# EAGLE design ESP32_sparrow (EAGLE 9.6.2)

## Sheet 1 of 2
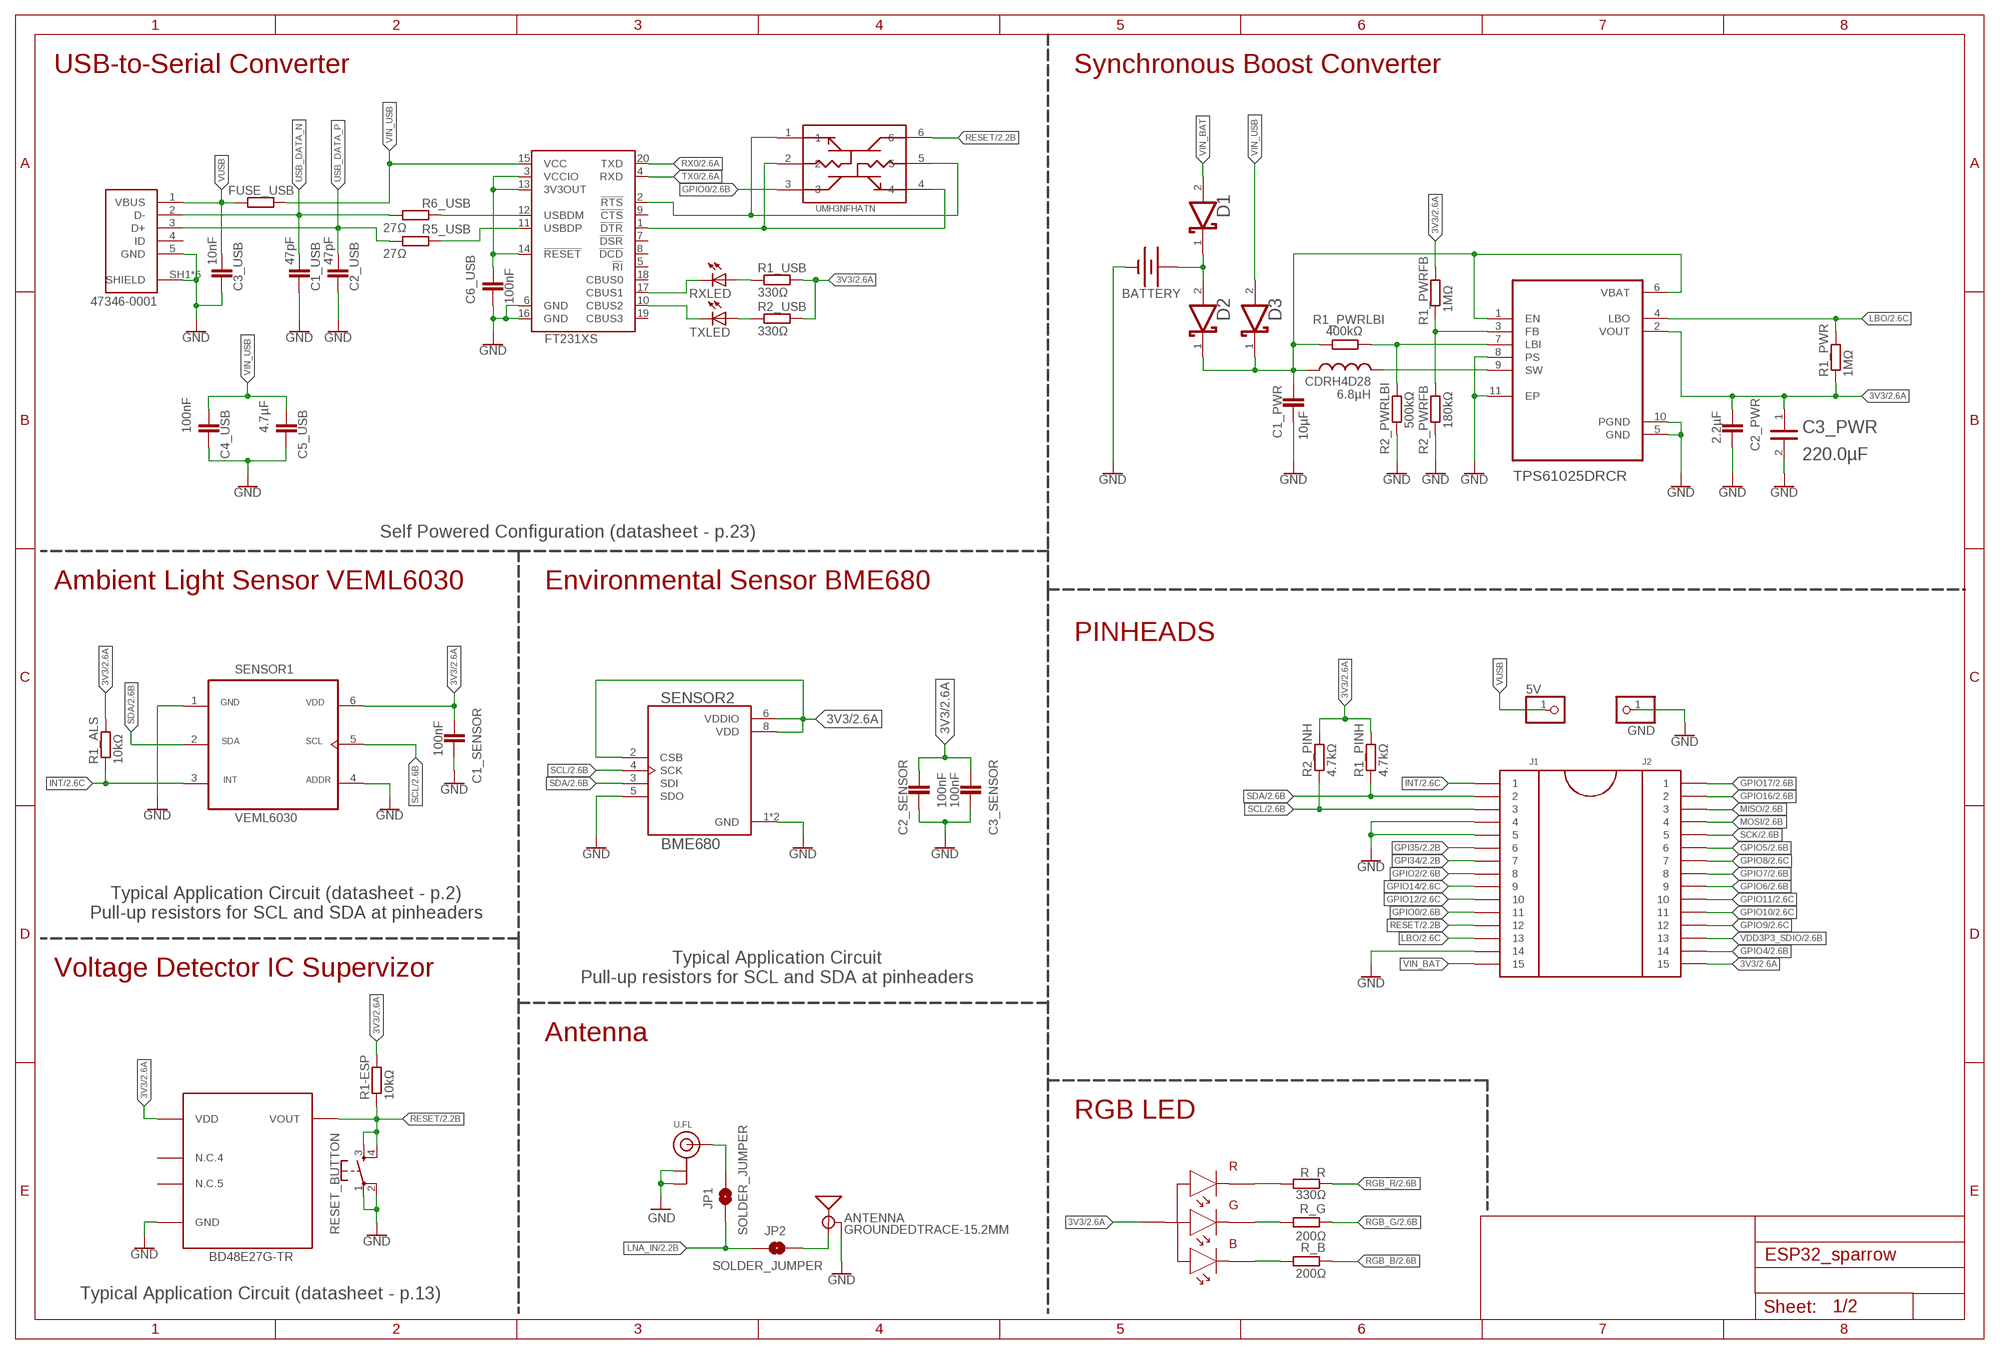
[diagram p0: schematic, sheet 1]

### Parts
5V  PINHD-1X1  [1X01]
ANTENNA  GROUNDEDTRACE-15.2MM  ANTENNA-GROUNDEDTRACE-15.2MM  [TRACE_ANTENNA_2.4GHZ_15.2MM]
BATTERY  BATTERY-AA  [BATTERY-AA]
BD48E27G-TR  BD48E27G-TR  [SSOP5]
C1_PWR  10µF  CC0402  [C0402]
C1_SENSOR  100nF  CC0402  [C0402]
C1_USB  47pF  CC0402  [C0402]
C2_PWR  2.2µF  CC0402  [C0402]
C2_SENSOR  100nF  CC0402  [C0402]
C2_USB  47pF  CC0402  [C0402]
C3_PWR  SAMSUNG_ELECTRO-MECHANICS_AMERICA_CL32A227MQVNNNESAMSUNG_ELECTRO-MECHANICS_AMERICA_CL32A227MQVNNNE_0_0  [SAMSUNG_ELECTRO-MECHANICS_AMERICA_CL32A227MQVNNNE_0]
C3_SENSOR  100nF  CC0402  [C0402]
C3_USB  10nF  CC0402  [C0402]
C4_USB  100nF  CC0402  [C0402]
C5_USB  4.7µF  CC0402  [C0402]
C6_USB  100nF  CC0402  [C0402]
CDRH4D28  6.8µH  L_US-CDRH4D28  [INDUCTOR_CDRH4]
CONVERTER  TPS61025DRCR  [VREG_V62/16624-01YE]
D1  AVX_SD0805S020S1R0AVX_SD0805S020S1R0_0_0  [AVX_SD0805S020S1R0_0]
D2  AVX_SD0805S020S1R0AVX_SD0805S020S1R0_0_0  [AVX_SD0805S020S1R0_0]
D3  AVX_SD0805S020S1R0AVX_SD0805S020S1R0_0_0  [AVX_SD0805S020S1R0_0]
FUSE_USB  PFMF.050.2  R-EU_1812X7R  [1812X7R]
GND  PINHD-1X1  [1X01]
J1  HEAD15-NOSS  [HEAD15-NOSS]
J2  HEAD15-NOSS-1  [HEAD15-NOSS-1]
JP1  SOLDER_JUMPER  JUMPER-SMT_2_NO_NO-SILK  [SMT-JUMPER_2_NO_NO-SILK]
JP2  SOLDER_JUMPER  JUMPER-SMT_2_NO_NO-SILK  [SMT-JUMPER_2_NO_NO-SILK]
MOLEX  47346-0001  [MOLEX_47346-0001]
R1-ESP  10kΩ  RR0402  [R0402]
R1_ALS  10kΩ  RR0402  [R0402]
R1_PINH  4.7kΩ  RR0402  [R0402]
R1_PWR  1MΩ  RR0402  [R0402]
R1_PWRFB  1MΩ  RR0402  [R0402]
R1_PWRLBI  400kΩ  RR0402  [R0402]
R1_USB  330Ω  RR0402  [R0402]
R2_PINH  4.7kΩ  RR0402  [R0402]
R2_PWRFB  180kΩ  RR0402  [R0402]
R2_PWRLBI  500kΩ  RR0402  [R0402]
R2_USB  330Ω  RR0402  [R0402]
R5_USB  27Ω  RR0402  [R0402]
R6_USB  27Ω  RR0402  [R0402]
R_B  200Ω  RR0402  [R0402]
R_G  200Ω  RR0402  [R0402]
R_R  330Ω  RR0402  [R0402]
RESET_BUTTON  MOMENTARY-SWITCH-SPST-2-SMD-4.6X2.8MM  [TACTILE_SWITCH_SMD_4.6X2.8MM]
RXLED  LEDCHIP-LED0603  [CHIP-LED0603]
SENSOR1  VEML6030  [VISHAY_VEML6030_2X2X0.87]
SENSOR2  BME680  [PSON80P300X300X100-8N]
TXLED  LEDCHIP-LED0603  [CHIP-LED0603]
U4  FT231XS  [SSOP20_L]
U$1  150202M153130-RGB  [150202M153130]
U.FL  ANTENNA_U.FL  [U.FL]
UMH3NFHATN  UMH3NFHATN  UMH3N  [SOP65P210X100-6N]

### Nets
3V3: BD48E27G-TR.P$2(VDD) C1_SENSOR.2 C2_PWR.2 C2_SENSOR.2 C3_PWR.1 C3_SENSOR.2 CONVERTER.2(VOUT) J2.15 R1-ESP.2 R1_ALS.2 R1_PINH.2 R1_PWR.1 R1_PWRFB.2 R1_USB.2 R2_PINH.2 R2_USB.2 SENSOR1.6(VDD) SENSOR2.2(CSB) SENSOR2.6(VDDIO) SENSOR2.8(VDD) U$1.P$1 ; also sheet 2
GND: ANTENNA.GND BATTERY.GND@1(-) BD48E27G-TR.P$3(GND) C1_PWR.1 C1_SENSOR.1 C1_USB.2 C2_PWR.1 C2_SENSOR.1 C2_USB.2 C3_PWR.2 C3_SENSOR.1 C3_USB.2 C4_USB.2 C5_USB.2 C6_USB.2 CONVERTER.5(GND) CONVERTER.8(PS) CONVERTER.10(PGND) CONVERTER.11(EP) GND.1 J1.4 J1.5 J1.14 MOLEX.5(GND) MOLEX.SH1(SHIELD) MOLEX.SH2(SHIELD) MOLEX.SH3(SHIELD) MOLEX.SH4(SHIELD) MOLEX.SH5(SHIELD) MOLEX.SH6(SHIELD) R2_PWRFB.1 R2_PWRLBI.1 RESET_BUTTON.1 RESET_BUTTON.2 SENSOR1.1(GND) SENSOR1.4(ADDR) SENSOR2.1(GND) SENSOR2.5(SDO) SENSOR2.7(GND) U4.6(GND) U4.16(GND) U.FL.1(GND) U.FL.2(GND) ; also sheet 2
GPI34: J1.7 ; also sheet 2
GPI35: J1.6 ; also sheet 2
GPIO0: J1.11 UMH3NFHATN.3 ; also sheet 2
GPIO2: J1.8 ; also sheet 2
GPIO4: J2.14 ; also sheet 2
GPIO5: J2.6 ; also sheet 2
GPIO6: J2.9 ; also sheet 2
GPIO7: J2.8 ; also sheet 2
GPIO8: J2.7 ; also sheet 2
GPIO9: J2.12 ; also sheet 2
GPIO10: J2.11 ; also sheet 2
GPIO11: J2.10 ; also sheet 2
GPIO12: J1.10 ; also sheet 2
GPIO14: J1.9 ; also sheet 2
GPIO16: J2.2 ; also sheet 2
GPIO17: J2.1 ; also sheet 2
INT: J1.1 R1_ALS.1 SENSOR1.3(INT) ; also sheet 2
LBO: CONVERTER.4(LBO) J1.13 R1_PWR.2 ; also sheet 2
LNA_IN: JP1.1 JP2.1 ; also sheet 2
MISO: J2.3 ; also sheet 2
MOSI: J2.4 ; also sheet 2
N$1: CONVERTER.7(LBI) R1_PWRLBI.2 R2_PWRLBI.2
N$3: R_B.2 U$1.P$4
N$4: R_G.2 U$1.P$3
N$5: R_R.2 U$1.P$2
N$6: U4.1(!DTR) UMH3NFHATN.2 UMH3NFHATN.4
N$7: U4.2(!RTS) UMH3NFHATN.1 UMH3NFHATN.5
N$8: ANTENNA.ANT(SIGNAL) JP2.2
N$9: C6_USB.1 U4.3(VCCIO) U4.13(3V3OUT) U4.14(!RESET)
N$10: C1_PWR.2 CDRH4D28.1 CONVERTER.1(EN) CONVERTER.6(VBAT) D2.1(CATHODE) D3.1(CATHODE) R1_PWRLBI.1
N$12: CONVERTER.3(FB) R1_PWRFB.1 R2_PWRFB.2
N$16: RXLED.C U4.17(CBUS1)
N$17: BATTERY.PWR@1(+) D1.1(CATHODE) D2.2(ANODE)
N$18: JP1.2 U.FL.3(SIGNAL)
N$20: R6_USB.2 U4.12(USBDM)
N$21: CDRH4D28.2 CONVERTER.9(SW)
N$22: R1_USB.1 RXLED.A
N$23: TXLED.C U4.10(CBUS2)
N$24: R2_USB.1 TXLED.A
N$26: R5_USB.2 U4.11(USBDP)
RESET: BD48E27G-TR.P$1(VOUT) J1.12 R1-ESP.1 RESET_BUTTON.3 RESET_BUTTON.4 UMH3NFHATN.6 ; also sheet 2
RGB_B: R_B.1 ; also sheet 2
RGB_G: R_G.1 ; also sheet 2
RGB_R: R_R.1 ; also sheet 2
RX0: U4.20(TXD) ; also sheet 2
SCK: J2.5 ; also sheet 2
SCL: J1.3 R2_PINH.1 SENSOR1.5(SCL) SENSOR2.4(SCK) ; also sheet 2
SDA: J1.2 R1_PINH.1 SENSOR1.2(SDA) SENSOR2.3(SDI) ; also sheet 2
TX0: U4.4(RXD) ; also sheet 2
USB_DATA_N: C1_USB.1 MOLEX.2(D-) R6_USB.1
USB_DATA_P: C2_USB.1 MOLEX.3(D+) R5_USB.1
VDD3P3_SDIO: J2.13 ; also sheet 2
VIN_BAT: D1.2(ANODE) J1.15
VIN_USB: C4_USB.1 C5_USB.1 D3.2(ANODE) FUSE_USB.2 U4.15(VCC)
VUSB: 5V.1 C3_USB.1 FUSE_USB.1 MOLEX.1(VBUS)
Unconnected: BD48E27G-TR.P$4(N.C.4) BD48E27G-TR.P$5(N.C.5) MOLEX.4(ID) U4.5(!RI) U4.7(!DSR) U4.8(!DCD) U4.9(!CTS) U4.18(CBUS0) U4.19(CBUS3)

### Notes on the sheet
- USB-to-Serial Converter | Synchronous Boost Converter
- Self Powered Configuration (datasheet - p.23)
- Ambient Light Sensor VEML6030 | Environmental Sensor BME680
- PINHEADS
- Typical Application Circuit (datasheet - p.2)
  Pull-up resistors for SCL and SDA at pinheaders
- Typical Application Circuit
  Pull-up resistors for SCL and SDA at pinheaders
- Voltage Detector IC Supervizor
- Antenna
- RGB LED
- Typical Application Circuit (datasheet - p.13)

## Sheet 2 of 2
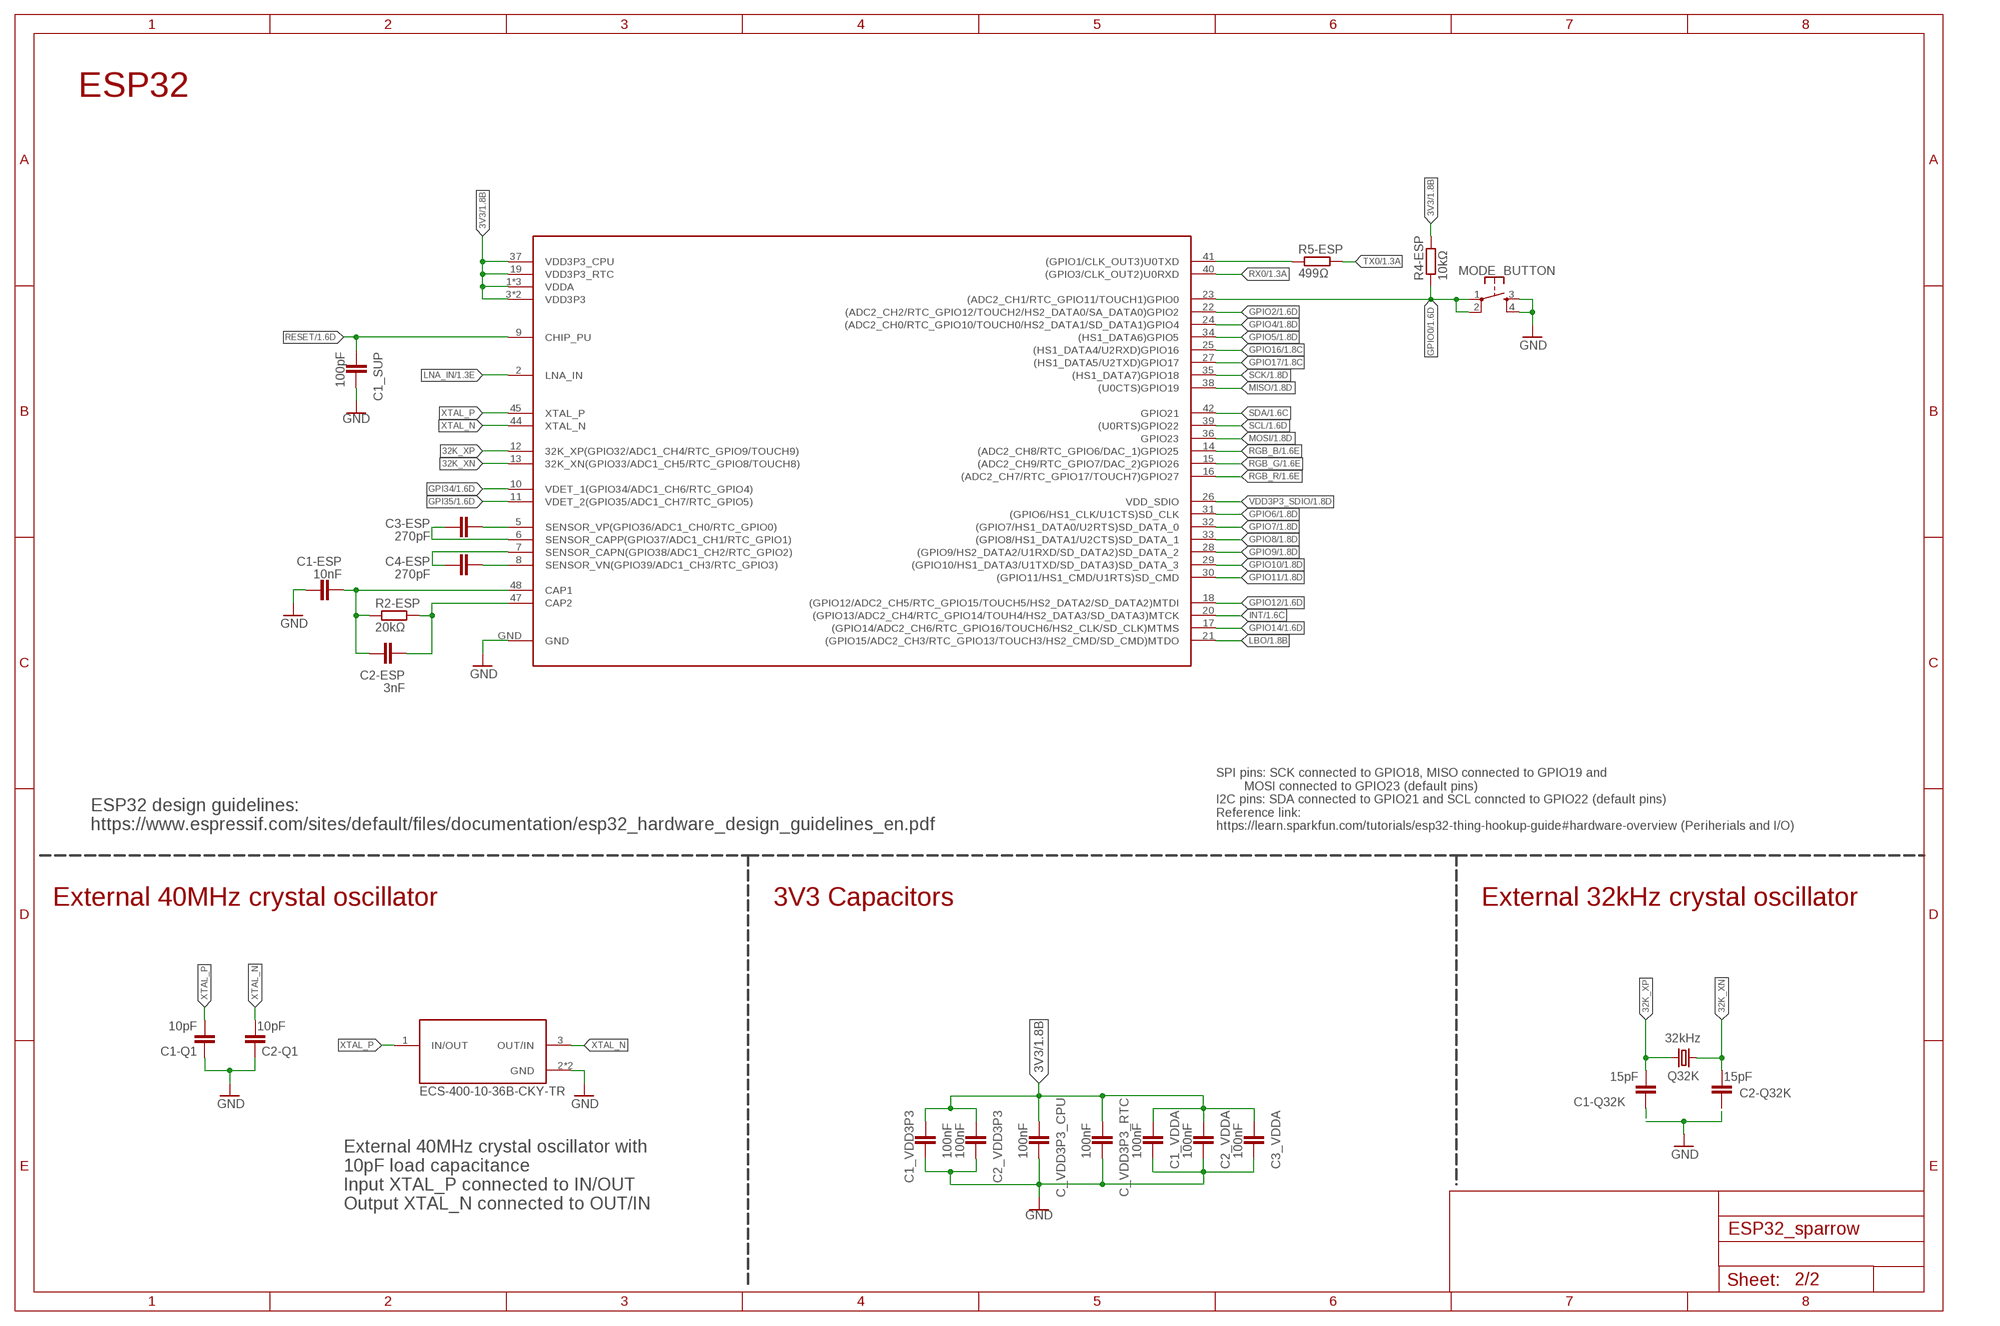
[diagram p1: schematic, sheet 2]

### Parts
C1-ESP  10nF  CC0402  [C0402]
C1-Q1  10pF  CC0402  [C0402]
C1-Q32K  15pF  CC0402  [C0402]
C1_SUP  100pF  CC0402  [C0402]
C1_VDD3P3  100nF  CC0402  [C0402]
C1_VDDA  100nF  CC0402  [C0402]
C2-ESP  3nF  CC0402  [C0402]
C2-Q1  10pF  CC0402  [C0402]
C2-Q32K  15pF  CC0402  [C0402]
C2_VDD3P3  100nF  CC0402  [C0402]
C2_VDDA  100nF  CC0402  [C0402]
C3-ESP  270pF  CC0402  [C0402]
C3_VDDA  100nF  CC0402  [C0402]
C4-ESP  270pF  CC0402  [C0402]
C_VDD3P3_CPU  100nF  CC0402  [C0402]
C_VDD3P3_RTC  100nF  CC0402  [C0402]
MODE_BUTTON  MOMENTARY-SWITCH-SPST-2-SMD-4.6X2.8MM  [TACTILE_SWITCH_SMD_4.6X2.8MM]
Q32K  32kHz  FC-12M  [FC-12M]
Q40M  ECS-400-10-36B-CKY-TR  [XTAL_ECS-163.84-10-36-JGN-TR]
R2-ESP  20kΩ  RR0402  [R0402]
R4-ESP  10kΩ  RR0402  [R0402]
R5-ESP  499Ω  RR0402  [R0402]
U$3  ESP32-U4WDH  [ESP32-U4WDH]

### Nets
3V3: C1_VDD3P3.2 C1_VDDA.2 C2_VDD3P3.2 C2_VDDA.2 C3_VDDA.2 C_VDD3P3_CPU.2 C_VDD3P3_RTC.2 R4-ESP.2 U$3.1(VDDA) U$3.3(VDD3P3) U$3.4(VDD3P3) U$3.19(VDD3P3_RTC) U$3.37(VDD3P3_CPU) U$3.43(VDDA) U$3.46(VDDA) ; also sheet 1
32K_XN: C2-Q32K.2 Q32K.1 U$3.13(32K_XN(GPIO33/ADC1_CH5/RTC_GPIO8/TOUCH8))
32K_XP: C1-Q32K.2 Q32K.2 U$3.12(32K_XP(GPIO32/ADC1_CH4/RTC_GPIO9/TOUCH9))
GND: C1-ESP.1 C1-Q1.1 C1-Q32K.1 C1_SUP.1 C1_VDD3P3.1 C1_VDDA.1 C2-Q1.1 C2-Q32K.1 C2_VDD3P3.1 C2_VDDA.1 C3_VDDA.1 C_VDD3P3_CPU.1 C_VDD3P3_RTC.1 MODE_BUTTON.3 MODE_BUTTON.4 Q40M.2(GND) Q40M.4(GND) U$3.GND ; also sheet 1
GPI34: U$3.10(VDET_1(GPIO34/ADC1_CH6/RTC_GPIO4)) ; also sheet 1
GPI35: U$3.11(VDET_2(GPIO35/ADC1_CH7/RTC_GPIO5)) ; also sheet 1
GPIO0: MODE_BUTTON.1 MODE_BUTTON.2 R4-ESP.1 U$3.23((ADC2_CH1/RTC_GPIO11/TOUCH1)GPIO0) ; also sheet 1
GPIO2: U$3.22((ADC2_CH2/RTC_GPIO12/TOUCH2/HS2_DATA0/SA_DATA0)GPIO2) ; also sheet 1
GPIO4: U$3.24((ADC2_CH0/RTC_GPIO10/TOUCH0/HS2_DATA1/SD_DATA1)GPIO4) ; also sheet 1
GPIO5: U$3.34((HS1_DATA6)GPIO5) ; also sheet 1
GPIO6: U$3.31((GPIO6/HS1_CLK/U1CTS)SD_CLK) ; also sheet 1
GPIO7: U$3.32((GPIO7/HS1_DATA0/U2RTS)SD_DATA_0) ; also sheet 1
GPIO8: U$3.33((GPIO8/HS1_DATA1/U2CTS)SD_DATA_1) ; also sheet 1
GPIO9: U$3.28((GPIO9/HS2_DATA2/U1RXD/SD_DATA2)SD_DATA_2) ; also sheet 1
GPIO10: U$3.29((GPIO10/HS1_DATA3/U1TXD/SD_DATA3)SD_DATA_3) ; also sheet 1
GPIO11: U$3.30((GPIO11/HS1_CMD/U1RTS)SD_CMD) ; also sheet 1
GPIO12: U$3.18((GPIO12/ADC2_CH5/RTC_GPIO15/TOUCH5/HS2_DATA2/SD_DATA2)MTDI) ; also sheet 1
GPIO14: U$3.17((GPIO14/ADC2_CH6/RTC_GPIO16/TOUCH6/HS2_CLK/SD_CLK)MTMS) ; also sheet 1
GPIO16: U$3.25((HS1_DATA4/U2RXD)GPIO16) ; also sheet 1
GPIO17: U$3.27((HS1_DATA5/U2TXD)GPIO17) ; also sheet 1
INT: U$3.20((GPIO13/ADC2_CH4/RTC_GPIO14/TOUH4/HS2_DATA3/SD_DATA3)MTCK) ; also sheet 1
LBO: U$3.21((GPIO15/ADC2_CH3/RTC_GPIO13/TOUCH3/HS2_CMD/SD_CMD)MTDO) ; also sheet 1
LNA_IN: U$3.2(LNA_IN) ; also sheet 1
MISO: U$3.38((U0CTS)GPIO19) ; also sheet 1
MOSI: U$3.36(GPIO23) ; also sheet 1
N$2: R5-ESP.1 U$3.41((GPIO1/CLK_OUT3)U0TXD)
N$11: C1-ESP.2 C2-ESP.1 R2-ESP.1 U$3.48(CAP1)
N$14: C2-ESP.2 R2-ESP.2 U$3.47(CAP2)
N$34: C3-ESP.1 U$3.6(SENSOR_CAPP(GPIO37/ADC1_CH1/RTC_GPIO1))
N$35: C3-ESP.2 U$3.5(SENSOR_VP(GPIO36/ADC1_CH0/RTC_GPIO0))
N$36: C4-ESP.1 U$3.7(SENSOR_CAPN(GPIO38/ADC1_CH2/RTC_GPIO2))
N$38: C4-ESP.2 U$3.8(SENSOR_VN(GPIO39/ADC1_CH3/RTC_GPIO3))
RESET: C1_SUP.2 U$3.9(CHIP_PU) ; also sheet 1
RGB_B: U$3.14((ADC2_CH8/RTC_GPIO6/DAC_1)GPIO25) ; also sheet 1
RGB_G: U$3.15((ADC2_CH9/RTC_GPIO7/DAC_2)GPIO26) ; also sheet 1
RGB_R: U$3.16((ADC2_CH7/RTC_GPIO17/TOUCH7)GPIO27) ; also sheet 1
RX0: U$3.40((GPIO3/CLK_OUT2)U0RXD) ; also sheet 1
SCK: U$3.35((HS1_DATA7)GPIO18) ; also sheet 1
SCL: U$3.39((U0RTS)GPIO22) ; also sheet 1
SDA: U$3.42(GPIO21) ; also sheet 1
TX0: R5-ESP.2 ; also sheet 1
VDD3P3_SDIO: U$3.26(VDD_SDIO) ; also sheet 1
XTAL_N: C2-Q1.2 Q40M.3(OUT/IN) U$3.44(XTAL_N)
XTAL_P: C1-Q1.2 Q40M.1(IN/OUT) U$3.45(XTAL_P)

### Notes on the sheet
- ESP32
- ESP32 design guidelines:
  https://www.espressif.com/sites/default/files/documentation/esp32_hardware_design_guidelines_en.pdf
- SPI pins: SCK connected to GPIO18, MISO connected to GPIO19 and 
          MOSI connected to GPIO23 (default pins)
  I2C pins: SDA connected to GPIO21 and SCL conncted to GPIO22 (default pins)
  Reference link: 
  https://learn.sparkfun.com/tutorials/esp32-thing-hookup-guide#hardware-overview (Periherials and I/O)
- External 40MHz crystal oscillator | 3V3 Capacitors | External 32kHz crystal oscillator
- External 40MHz crystal oscillator with 
  10pF load capacitance
  Input XTAL_P connected to IN/OUT
  Output XTAL_N connected to OUT/IN

## Library data of the parts
5V GND = pinhead:PINHD-1X1: PIN HEADER
ANTENNA = SparkFun-RF:ANTENNA-GROUNDED: Antenna w/ Ground Connection 2.4GHz antennae with signal and ground terminals. TRACE_ANTENNA_2.4GHZ_15.2MM - Meander Trace antenna 15.2 x 5.7mm footprint Based on layout from TI app note AN043 <http://www.ti.com/lit/an/swra117d/swra117d.pdf>. TRACE_ANTENNA_2.4GHZ_25.7MM - Inverted F trace antenna 25.7 x 7.5 mm footprint. Based on layout from TI design note DN0007 <http://www.ti.com/lit/an/swru120b/swru120b.pdf>.
BATTERY = SparkFun-Batteries2:BATTERY: Battery - Single Cell A variety of battery chemistries, sizes, and footprints. Device List: 20MM_PTH - Coin Cell Battery Holder - 20mm (PTH) <https://www.sparkfun.com/products/783> 6.8MM_PTH - Coin Cell Battery Holder - 6.8MM(SMD) <https://www.digikey.com/product-detail/en/seiko-instruments/MS621FE-FL11E/728-1057-ND/1889208?WT.srch=1&gclid=CNOQ5a6LzdQCFZS2wAodXCkE0g> 12MM_SMD - Coin Cell Battery Holder - 12mm (SMD) <https://www.sparkfun.com/products/10592> 12MM_PTH - Coin Cell Battery Holder - 12mm (PTH) <https://www.sparkfun.com/products/7948> 20MM_SMD - 20mm Coin Cell Battery Holder (SMD) (2 legs) Used on the Big Time Watch Kit <https://www.sparkfun.com/products/11734> 20MM_SMD_4LEGS - Coin Cell Battery Holder - 20mm (SMD) <https://www.sparkfun.com/products/11892> 20MM_SMD_4LEGS_OVERPASTE - Coin Cell Battery Holder - 20mm (SMD) <https://www.sparkfun.com/products/11892> (Over-paste on the legs) 24.5MM_PTH - Coin Cell Battery Holder - 24.5mm (PTH) <https://www.sparkfun.com/products/8863> 9V - 9V Battery Holder - PC Mount Used on the SparkFun SparkPunk Sound Kit <https://www.sparkfun.com/products/11177> and SparkFun SparkPunk Sequencer Kit <https://www.sparkfun.com/products/12707> 18650 - Battery Holder - 18650 (PTH) <https://www.sparkfun.com/products/13113> AA - Battery Holder - 1xAA (PTH) <https://www.sparkfun.com/products/7949> AAA - Battery Holder - 1xAAA (PTH) <https://www.sparkfun.com/products/12718> AA_KIT - Battery Holder - 1xAA (PTH) <https://www.sparkfun.com/products/7949> Special kit package - pads only have exposed copper on one side of the board. AAA_KIT - Battery Holder - 1xAAA (PTH) <https://www.sparkfun.com/products/12718> Special kit package - pads only have exposed copper on one side of the board.; PROD_ID: BATT-08316; SF_SKU: PRT-07949
BD48E27G-TR = BD48E27G-TR:BD48E27G-TR
C1-ESP C1-Q1 C1-Q32K C1_PWR C1_SENSOR C1_SUP C1_USB C1_VDD3P3 C1_VDDA C2-ESP C2-Q1 C2-Q32K C2_PWR C2_SENSOR C2_USB C2_VDD3P3 C2_VDDA C3-ESP C3_SENSOR C3_USB C3_VDDA C4-ESP C4_USB C5_USB C6_USB C_VDD3P3_CPU C_VDD3P3_RTC = eagle-ltspice:C: CAPACITOR, European symbol; SPICEMODEL: NONE; SPICEPREFIX: C
C3_PWR = Samsung Electro-Mechanics America - CL32A227MQVNNNE:SAMSUNG_ELECTRO-MECHANICS_AMERICA_CL32A227MQVNNNE: Multi-layer Ceramic Capacitor; CAPACITANCE: 220.0µF; CENTROID_NOT_SPECIFIED: No; DATASHEET: http://www.samsungsem.com/kr/support/product-search/mlcc/__icsFiles/afieldfile/2015/08/14/S_CL32A227MQVNNNE.pdf; DIGIKEY_DESCRIPTION: CAP CER 220UF 6.3V X5R 1210; DIGIKEY_PART_NUMBER: 1276-3375-1-ND; IPC_LAND_PATTERN_NAME: CAPC320250X250; LEAD_FREE: yes; MF: Samsung Electro-Mechanics America; MPN: CL32A227MQVNNNE; PACKAGE: 1210 (3225 metric); PREFIX: C; ROHS: yes; TEMPERATURE_RANGE_HIGH: +85°C; TEMPERATURE_RANGE_LOW: -55°C; VOLTAGE: 6.3V
CDRH4D28 = m-pad-2.1:L_US: Inductors in various packages from: - Sumida - Panasonic - Coilcraft
CONVERTER = TPS61025DRCR:TPS61025DRCR: Check prices <https://pricing.snapeda.com/parts/TPS61025DRCR/Texas%20Instruments/view-part?ref=eda>; AVAILABILITY: Good; DESCRIPTION: 3.3-V Output, 1.5-A Switch, 96% Efficient Boost Converter w/ LDO Down-Mode, QFN-10 10-VSON -40 to 85; MF: Texas Instruments; MP: TPS61025DRCR; PACKAGE: VSON-10 Texas Instruments; PRICE: None; PURCHASE-URL: https://pricing.snapeda.com/search/part/TPS61025DRCR/?ref=eda
D1-D3 = AVX - SD0805S020S1R0:AVX_SD0805S020S1R0: Schottky Barrier Rectifier Diode; CENTROID_NOT_SPECIFIED: No; DATASHEET: http://datasheets.avx.com/schottky.pdf; DIGIKEY_DESCRIPTION: DIODE SCHOTTKY 20V 1A 0805; DIGIKEY_PART_NUMBER: 478-7800-1-ND; LEAD_FREE: yes; MF: AVX; MOUSER_PART_NUMBER: 581-SD0805S020S1R0; MPN: SD0805S020S1R0; PACKAGE: 0805 (2012 metric); PREFIX: D; ROHS: yes; TEMPERATURE_RANGE_HIGH: +125°C; TEMPERATURE_RANGE_LOW: -55°C
FUSE_USB = rcl:R-EU_: RESISTOR, European symbol; SPICEPREFIX: R
J1 = MyCON2:HEAD15-NOSS
J2 = MyCON2:HEAD15-NOSS-1
JP1 JP2 = SparkFun-Jumpers:JUMPER-SMT_2_NO: Normally open jumper This jumper has two pads in close proximity to each other. Apply solder to close the connection. Round pads are easier to solder for beginners, but are a lot larger. SparkFun Product that uses the round pads: SparkFun EL Sequencer <https://www.sparkfun.com/products/12781>
MODE_BUTTON RESET_BUTTON = SparkFun-Switches:MOMENTARY-SWITCH-SPST-2: Momentary Switch (Pushbutton) - SPST - Two Circuits Normally-open (NO) SPST momentary switches (buttons, pushbuttons). Schematic symbol includes two switch circuits. Variants SMD-4.6MMX2.8MM - 4.60mm x 2.80mm Tactile Momentary Button Switch - Used on SparkFun SAMD21 Mini Breakout <https://www.sparkfun.com/products/13664> SMD-5.2MM - Mini Pushbutton Switch - SMD <https://www.sparkfun.com/products/8720> - Used on Arduino Pro Mini <https://www.sparkfun.com/products/11114>; PROD_ID: SWCH-13065
MOLEX = 47346-0001:47346-0001: CONN RCPT 5POS MICRO USB R/A SMD Check prices <https://pricing.snapeda.com/parts/47346-0001/Molex/view-part?ref=eda>; AVAILABILITY: Warning; DESCRIPTION: USB - micro B USB 2.0 Receptacle Connector 5 Position Surface Mount, Right Angle; MF: Molex; MP: 47346-0001; PACKAGE: None; PRICE: None
Q32K = crystal:FC-12M: kHz RANGE CRYSTAL UNIT LOW PROFILE SMD Source: Epson Toyocom FC-12M.pdf
Q40M = ECS-400-10-36B-CKY-TR:ECS-400-10-36B-CKY-TR: The minature ECX-2236 is a compact SMD Crystal. The industry standard 2.5 x 2.0 x 0.55 mm ceramic package is ideal for today’s SMD manufacturing environment. Check prices <https://pricing.snapeda.com/parts/ECS-400-10-36B-CKY-TR/ECS%20Inc./view-part?ref=eda>; AVAILABILITY: Warning; DESCRIPTION: 40MHz ±10ppm Crystal 10pF 30 Ohms 4-SMD, No Lead; MF: ECS Inc.; MP: ECS-400-10-36B-CKY-TR; PACKAGE: SMD-4 ECS International; PRICE: None; PURCHASE-URL: https://pricing.snapeda.com/search/part/ECS-400-10-36B-CKY-TR/?ref=eda
R1-ESP R1_ALS R1_PINH R1_PWR R1_PWRFB R1_PWRLBI R1_USB R2-ESP R2_PINH R2_PWRFB R2_PWRLBI R2_USB R4-ESP R5-ESP R5_USB R6_USB R_B R_G R_R = eagle-ltspice:R: RESISTOR, European symbol; SPICEMODEL: NONE; SPICEPREFIX: R
RXLED TXLED = adafruit:LED: LED OSRAM: - CHIPLED LG R971, LG N971, LY N971, LG Q971, LY Q971, LO R971, LY R971 LH N974, LH R974 LS Q976, LO Q976, LY Q976 LO Q996 - Hyper CHIPLED LW Q18S LB Q993, LB Q99A, LB R99A - SideLED LS A670, LO A670, LY A670, LG A670, LP A670 LB A673, LV A673, LT A673, LW A673 LH A674 LY A675 LS A676, LA A676, LO A676, LY A676, LW A676 LS A679, LY A679, LG A679 - Hyper Micro SIDELED® LS Y876, LA Y876, LO Y876, LY Y876 LT Y87S - SmartLED LW L88C, LW L88S LB L89C, LB L89S, LG L890 LS L89K, LO L89K, LY L89K LS L896, LA L896, LO L896, LY L896 - TOPLED LS T670, LO T670, LY T670, LG T670, LP T670 LSG T670, LSP T670, LSY T670, LOP T670, LYG T670 LG T671, LOG T671, LSG T671 LB T673, LV T673, LT T673, LW T673 LH T674 LS T676, LA T676, LO T676, LY T676, LB T676, LH T676, LSB T676, LW T676 LB T67C, LV T67C, LT T67C, LS T67K, LO T67K, LY T67K, LW E67C LS E67B, LA E67B, LO E67B, LY E67B, LB E67C, LV E67C, LT E67C LW T67C LS T679, LY T679, LG T679 LS T770, LO T770, LY T770, LG T770, LP T770 LB T773, LV T773, LT T773, LW T773 LH T774 LS E675, LA E675, LY E675, LS T675 LS T776, LA T776, LO T776, LY T776, LB T776 LHGB T686 LT T68C, LB T68C - Hyper Mini TOPLED® LB M676 - Mini TOPLED Santana® LG M470 LS M47K, LO M47K, LY M47K Source: http://www.osram.convergy.de/
SENSOR1 = VEML6030:VEML6030: VEML6030 High Accuracy Ambient Light Sensor with I2C Interface: VEML6030 is a high accuracy ambient light digital 16-bit resolution sensor in a miniature transparent 2 mm x 2 mm package. It includes a high sensitive photodiode, a low noise amplifier, a 16-bit A/D converter and supports an easy to use I2C bus communication interface and additional interrupt feature. The ambient light result is as digital value available. Device Model created 15.06.2016 by Johannes Kolb - Vishay Semiconductor GmbH Check prices <https://pricing.snapeda.com/parts/VEML6030/Vishay/view-part?ref=eda>; AVAILABILITY: In Stock; DESCRIPTION: Optical Sensor Ambient 550nm I²C 6-SMD, No Lead; MF: Vishay; MP: VEML6030; PACKAGE: SMD-6 Vishay; PRICE: None
SENSOR2 = BME680:BME680: Integrated Environmental Unit; AVAILABILITY: Unavailable; DESCRIPTION: Integrated Environmental Unit; MF: Bosch Sensortec; MP: BME680; PACKAGE: LGA-8 Bosch Tools; PRICE: None
U4 = SparkFun-IC-Comms:FT231X: FTDI FT231X Full Speed USB to Full-handshake UART This USB2.0 Full Speed IC offers a compact bridge to full handshake UART interfaces. The device is a UART, capable of operating up to 3MBaud, with low power consumption (8mA). The FT231X includes the complete FT-X series feature set and enables USB to be added into a system design quickly and easily over a UART interface. Datasheet <http://cdn.sparkfun.com/datasheets/Components/General%20IC/DS_FT231X.pdf> SparkFun Products SparkFun RedBoard - Programmed with Arduino <https://www.sparkfun.com/products/12757> (DEV-12757) SparkFun XBee Explorer USB <https://www.sparkfun.com/products/11812> (WRL-11812) SparkFun XBee Explorer Dongle <https://www.sparkfun.com/products/11697> (WRL-11697) SparkFun Blynk Board - ESP8266 <https://www.sparkfun.com/products/13794> (WRL-13794) SparkFun ESP8266 Thing - Dev Board <https://www.sparkfun.com/products/13711> (WRL-13711) SparkFun Block for Intel® Edison - Base <https://www.sparkfun.com/products/13045> (DEV-13045) SparkFun RedStick <https://www.sparkfun.com/products/13741> (DEV-13741) SparkFun Beefy 3 - FTDI Basic Breakout <https://www.sparkfun.com/products/13746> (DEV-13746) SparkFun FT231X Breakout <https://www.sparkfun.com/products/11736> (BOB-11736); PROD_ID: IC-11524
U$1 = 150202M153130:150202M153130-RGB
U$3 = my_esp32:ESP32-U4WDH
U.FL = adafruit:ANTENNA_U.FL: U.FL Antenna Connector
UMH3NFHATN = UMH3N:UMH3N: Dual PNP/NPN transistor for chip reset; AVAILABILITY: Unavailable; DESCRIPTION: Pre-Biased Bipolar Transistor (BJT) 2 NPN - Pre-Biased (Dual) 50V 100mA 250MHz 150mW Surface Mount UMT6; MF: Rohm; MP: UMH3N; PACKAGE: SOT-363 Rohm; PRICE: None

## Board
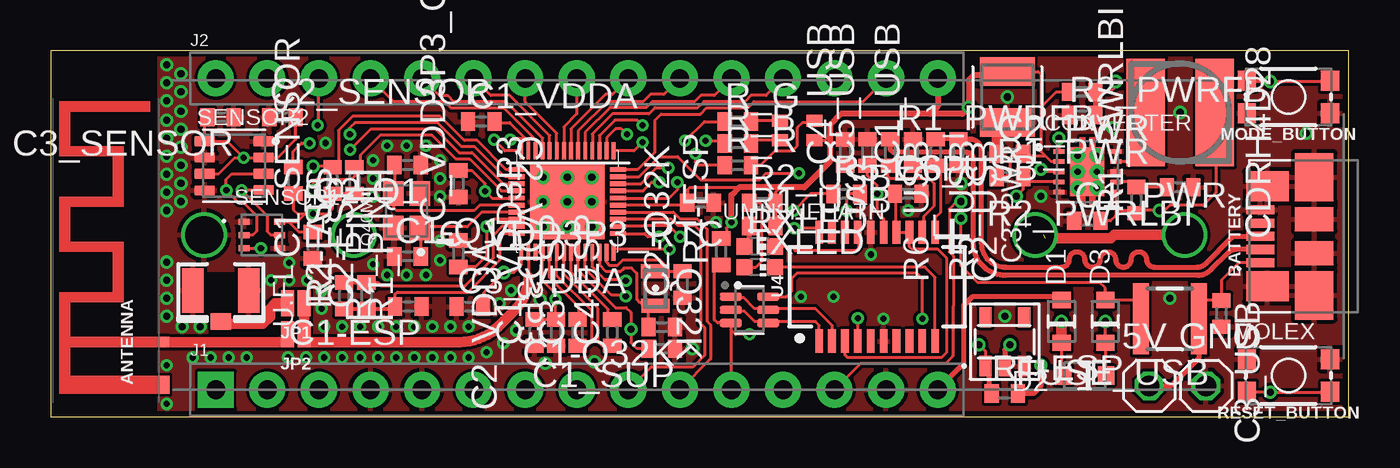
[diagram p2: board, top side]
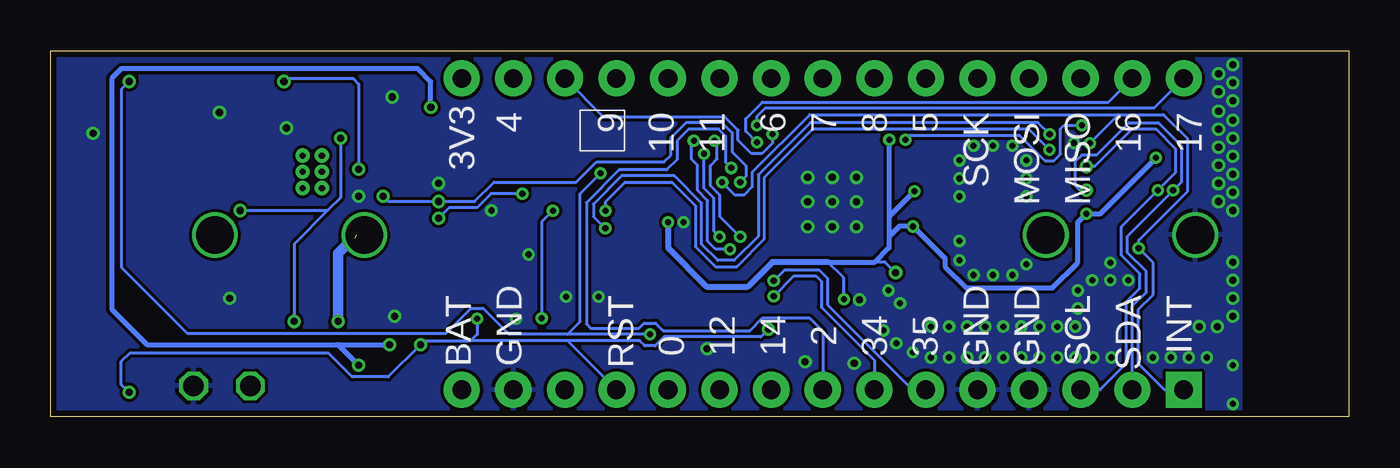
[diagram p3: board, bottom side, seen from below]

Size 63.93 x 18.02 mm. Coordinates in mm from the lower left corner, seen from the top.
Outline: 0,0 63.93,0 63.93,18.02 0,18.02 0,0
Copper layers (1*16): Top 0.035mm / dielectric 1.5mm / Bottom 0.035mm
Design rules "PCB-POOL Standard": minimum track width 0.15mm, minimum drill 0.3mm, track to track 0.15mm, track to pad 0.15mm, pad to pad 0.15mm, via to via 0.15mm, smd to smd 0.15mm, copper to edge 0.3mm, drill to drill 0.2mm, minimum pad ring 0.2mm, minimum via ring 0.15mm, stop-mask expansion 0.03mm, vias tented up to drill 0mil, thermal gap 0.2mm

### Footprints (pad centres in the part's own frame; a part is rotated, then mirrored left to right if it is on the bottom)
1X01 = drill 1.016 octagon: 1 0,0
TRACE_ANTENNA_2.4GHZ_15.2MM = smd 0.5 x 0.5: ANT 0,-0.25 | smd 0.9 x 0.5: GND -2.1,-0.25
BATTERY-AA = drill 1.854: GND@1 25.146,0; GND@2 17.78,0; PWR@1 -23.146,0; PWR@2 -15.78,0
SSOP5 = smd 0.6 x 1: P$1 -0.95,-0.8; P$2 0,-0.8; P$3 0.95,-0.8; P$4 0.95,1.6; P$5 -0.95,1.6
C0402 = smd 0.7 x 0.9: 1 -0.65,0; 2 0.65,0
SAMSUNG_ELECTRO-MECHANICS_AMERICA_CL32A227MQVNNNE_0 = smd 1.403 x 2.704: 1 -1.25,0; 2 1.25,0
INDUCTOR_CDRH4 = smd 5.3 x 1.9: 1 0,1.7; 2 0,-1.7
VREG_V62/16624-01YE = smd 0.6 x 0.24: 1 -1.4,1; 2 -1.4,0.5; 3 -1.4,0; 4 -1.4,-0.5; 5 -1.4,-1; 6 1.4,-1; 7 1.4,-0.5; 8 1.4,0; 9 1.4,0.5; 10 1.4,1 | smd 1.65 x 2.4: 11 0,0 | drill 0.3 pad 0.406: 12 0.475,0; 13 -0.475,0; 14 -0.475,-0.8; 15 0.475,-0.8; 16 -0.475,0.8; 17 0.475,0.8
AVX_SD0805S020S1R0_0 = smd 0.8 x 0.9: 1 -1.05,0; 2 1.05,0
1812X7R = smd 0.8 x 3.5: 1 -1.425,0; 2 1.425,0
HEAD15-NOSS = drill 0.914 pad 1.778 square: 1 0,0 | drill 0.914 pad 1.778: 2 2.54,0; 3 5.08,0; 4 7.62,0; 5 10.16,0; 6 12.7,0; 7 15.24,0; 8 17.78,0; 9 20.32,0; 10 22.86,0; 11 25.4,0; 12 27.94,0; 13 30.48,0; 14 33.02,0; 15 35.56,0
HEAD15-NOSS-1 = drill 0.914 pad 1.778: 1 0,0; 2 2.54,0; 3 5.08,0; 4 7.62,0; 5 10.16,0; 6 12.7,0; 7 15.24,0; 8 17.78,0; 9 20.32,0; 10 22.86,0; 11 25.4,0; 12 27.94,0; 13 30.48,0; 14 33.02,0; 15 35.56,0
SMT-JUMPER_2_NO_NO-SILK = smd 0.635 x 1.27: 1 -0.406,0; 2 0.406,0
TACTILE_SWITCH_SMD_4.6X2.8MM = smd 0.9 x 1: 1 -2.05,-0.8; 2 2.05,-0.8; 3 2.05,0.8; 4 -2.05,0.8
MOLEX_47346-0001 = smd 0.45 x 1.38: 1 -1.3,2.66; 2 -0.65,2.66; 3 0,2.66; 4 0.65,2.66; 5 1.3,2.66 | smd 1.475 x 2.1: SH1 -2.462,2.3; SH2 2.462,2.3 | smd 2.375 x 1.9: SH3 -2.913,0; SH6 2.913,0 | smd 1.175 x 1.9: SH4 -0.838,0; SH5 0.838,0
FC-12M = smd 0.7 x 1.4: 1 -0.85,0; 2 0.85,0
XTAL_ECS-163.84-10-36-JGN-TR = smd 1.2 x 1: 1 -0.85,-0.65; 2 0.85,-0.65; 3 0.85,0.65; 4 -0.85,0.65
R0402 = smd 0.7 x 0.9: 1 -0.65,0; 2 0.65,0
CHIP-LED0603 = smd 0.8 x 0.8: A 0,-0.75; C 0,0.75
VISHAY_VEML6030_2X2X0.87 = smd 0.55 x 0.3: 1 -0.875,0.65; 2 -0.875,0; 3 -0.875,-0.65; 4 0.875,-0.65; 5 0.875,0; 6 0.875,0.65
PSON80P300X300X100-8N = smd 1.016 x 0.5: 1 1.458,1.2; 2 1.458,0.4; 3 1.458,-0.4; 4 1.458,-1.2; 5 -1.458,-1.22; 6 -1.458,-0.4; 7 -1.458,0.4; 8 -1.458,1.2
SSOP20_L = smd 0.381 x 1.143: 1 -2.857,-2.68; 2 -2.223,-2.68; 3 -1.587,-2.68; 4 -0.953,-2.68; 5 -0.318,-2.68; 6 0.318,-2.68; 7 0.953,-2.68; 8 1.587,-2.68; 9 2.223,-2.68; 10 2.857,-2.68; 11 2.857,2.68; 12 2.223,2.68; 13 1.587,2.68; 14 0.953,2.68; 15 0.318,2.68; 16 -0.318,2.68; 17 -0.953,2.68; 18 -1.587,2.68; 19 -2.223,2.68; 20 -2.857,2.68
150202M153130 = smd 0.8 x 0.6: P$1 -0.85,0.475; P$2 -0.85,-0.475; P$3 0.85,-0.475; P$4 0.85,0.475
ESP32-U4WDH = smd 0.2 x 0.8: 1 -2.275,-2.5; 2 -1.925,-2.5; 3 -1.575,-2.5; 4 -1.225,-2.5; 5 -0.875,-2.5; 6 -0.525,-2.5; 7 -0.175,-2.5; 8 0.175,-2.5; 9 0.525,-2.5; 10 0.875,-2.5; 11 1.225,-2.5; 12 1.575,-2.5; 13 1.925,-2.5; 14 2.275,-2.5; 25 2.275,2.5; 26 1.925,2.5; 27 1.575,2.5; 28 1.225,2.5; 29 0.875,2.5; 30 0.525,2.5; 31 0.175,2.5; 32 -0.175,2.5; 33 -0.525,2.5; 34 -0.875,2.5; 35 -1.225,2.5; 36 -1.575,2.5; 37 -1.925,2.5; 38 -2.275,2.5 | smd 0.8 x 0.2: 15 2.5,-1.575; 16 2.5,-1.225; 17 2.5,-0.875; 18 2.5,-0.525; 19 2.5,-0.175; 20 2.5,0.175; 21 2.5,0.525; 22 2.5,0.875; 23 2.5,1.225; 24 2.5,1.575; 39 -2.5,1.575; 40 -2.5,1.225; 41 -2.5,0.875; 42 -2.5,0.525; 43 -2.5,0.175; 44 -2.5,-0.175; 45 -2.5,-0.525; 46 -2.5,-0.875; 47 -2.5,-1.225; 48 -2.5,-1.575 | smd 3.7 x 3.7: GND 0,0
U.FL = smd 2.2 x 1.05: 1 0,1.375; 2 0,-1.375 | smd 0.8 x 1: 3 1.525,0
SOP65P210X100-6N = smd 1.09 x 0.4: 1 -0.92,0.65; 2 -0.92,0; 3 -0.92,-0.65; 4 0.92,-0.65; 5 0.92,0; 6 0.92,0.65

### Placement (x,y rotation side)
5V  54.1,1.52 0 top
ANTENNA  5.33,3.68 90 top
BATTERY  32.7,8.95 180 top
BD48E27G-TR  46.99,3.3 0 top
C1-ESP  17.61,5.43 180 top
C1-Q1  17.58,7.9 0 top
C1-Q32K  30.1,4.42 180 top
C1_PWR  51.05,9.65 0 top
C1_SENSOR  12.91,8.45 90 top
C1_SUP  30.1,3.36 180 top
C1_USB  42.46,13.02 90 top
C1_VDD3P3  23.83,4.15 89.9 top
C1_VDDA  21.21,14.54 0 top
C2-ESP  15.55,5.97 90 top
C2-Q1  17.58,12.4 180 top
C2-Q32K  31.11,6.51 90 top
C2_PWR  47.24,12.95 0 top
C2_SENSOR  11.42,14.75 0 top
C2_USB  44.7,13.02 270 top
C2_VDD3P3  24.89,4.15 90.1 top
C2_VDDA  20.08,8.03 270 top
C3-ESP  25.95,4.15 90 top
C3_PWR  47.12,15.75 270 top
C3_SENSOR  8.37,14.75 180 top
C3_USB  57.66,5.08 270 top
C3_VDDA  20.65,5.43 0 top
C4-ESP  27.66,4.15 90 top
C4_USB  39.13,13.01 90 top
C5_USB  40.22,13.02 90 top
C6_USB  42.23,10.99 0 top
C_VDD3P3_CPU  20.08,11.48 90 top
C_VDD3P3_RTC  32,10.54 180 top
CDRH4D28  55.63,14.99 270 top
CONVERTER  51.05,12.06 0 top
D1  49.78,4.7 90 top
D2  50.93,2.03 180 top
D3  51.94,4.7 90 top
FUSE_USB  55.12,4.83 180 top
GND  56.9,1.52 0 top
J1  8.13,1.33 0 top
J2  8.13,16.66 0 top
JP1  12.06,5.59 180 top
JP2  12.06,4.06 180 top
MODE_BUTTON  60.96,15.75 180 top
MOLEX  62.23,8.89 90 top
Q32K  29.78,6.32 270.2 top
Q40M  17.53,10.15 90 top
R1-ESP  46.99,1.14 0 top
R1_ALS  11.95,11.65 270 top
R1_PINH  14.96,11.63 270 top
R1_PWR  47.24,11.81 0 top
R1_PWRFB  50.8,16 180 top
R1_PWRLBI  53.47,10.67 90 top
R1_USB  35.05,9.4 0 top
R2-ESP  14.45,5.96 90 top
R2_PINH  13.88,11.63 270 top
R2_PWRFB  50.8,14.86 0 top
R2_PWRLBI  55.63,11.3 180 top
R2_USB  35.05,10.54 0 top
R4-ESP  33.02,8.13 90 top
R5-ESP  39.2,10.97 0 top
R5_USB  43.58,13.02 270 top
R6_USB  41.34,13.02 270 top
R_B  33.85,13.46 0 top
R_G  33.85,14.54 0 top
R_R  33.85,12.38 0 top
RESET_BUTTON  60.96,2.03 180 top
RXLED  34.92,8.38 270 top
SENSOR1  10.4,8.95 0 top
SENSOR2  9.03,12.37 0 top
TXLED  34.92,7.37 270 top
U4  40.7,6.41 0 top
U$1  36.77,14.1 180 top
U$3  25.45,10.6 0 top
U.FL  8.38,6.22 270 top
UMH3NFHATN  34.42,5.27 0 top

### Tracks (layer width: path | path; a pad name or v marks a point on that pad's centre or on a via)
3V3  (via drill 0.3, 0.35)
  Top 0.152: CONVERTER.2 49.27,12.56 49.02,12.82 | 49.02,12.82 48.77,13.07 48.77,15.24 | 49.02,12.82 48.03,12.82 | 48.77,15.24 48.77,16.87 48.64,17 C3_PWR.1 | 48.77,15.24 49.53,16 R1_PWRFB.2 | C2_PWR.2 47.43,12.95 47.24,12.76 47.24,12.03 47.02,11.81 R1_PWR.1 | C3_VDDA.2 21.34,5.48 21.34,6.13 v22.32,7.1 22.8,7.1 23.18,7.47 U$3.1 | C1_VDDA.2 21.91,14.49 22.6,14.49 23.37,13.72 | R1_USB.2 R2_USB.2 35.7,11.05 35.96,11.3 | U$1.P$1 38.13,13.62 38.37,13.86 | R1_PINH.2 R2_PINH.2 13.88,10.23 13.65,10 v12.93,10 12.53,10 | v33.53,9.59 33.53,9.54 33.27,9.29 33.27,9.03 R4-ESP.2 | 33.91,11.3 31.48,11.3 31.35,11.18 C_VDD3P3_RTC.2 31.24,10.43 U$3.19 | C_VDD3P3_CPU.2 20.75,12.13 21.39,11.48 v21.39,11.1 21.73,10.78 U$3.43 | C2_VDDA.2 20.92,7.38 21.46,7.92 v21.46,9.37 21.81,9.72 U$3.46 | U$3.3 U$3.4 24.23,6.7 24.87,6.06 v24.87,5.79 24.87,4.81 | C2_VDD3P3.2 24.87,4.81 | C1_VDD3P3.2 23.85,4.81 24.87,4.81 | 23.37,13.72 23.52,13.57 U$3.37 | v22.63,13.65 22.71,13.73 23.37,13.73 23.37,13.72 | 23.37,13.72 | v9.5,12.75 9.05,12.75 8.27,11.97 SENSOR2.6 | v9.5,12.75 8.68,13.57 SENSOR2.8 7.58,14.61 C3_SENSOR.2 | C1_SENSOR.2 12.23,9.1 11.72,9.6 | SENSOR1.6 11.72,9.6 | 11.72,9.6 12.12,9.6 12.53,10 | v9.5,12.75 9.52,12.77 SENSOR2.2 11.17,12.77 12.07,13.67 C2_SENSOR.2 | R1_ALS.2 11.95,10.2 12.15,10 12.53,10
  Top 0.254: 48.03,12.82 C2_PWR.2 | v47.24,3.56 46.99,3.3 BD48E27G-TR.P$2 | R1-ESP.2 48.4,1.14 48.77,1.51 v48.77,2.54
  Top 0.305: C3_PWR.1 46.95,16.83 45.47,16.83 45.21,16.57 v45.21,15.24 44.9,14.92 43.31,14.92 | 43.31,14.92 38.92,14.92 38.37,14.36 38.37,13.86 38.37,12.56 37.12,11.3 35.96,11.3 33.91,11.3 33.53,10.92 v33.53,9.59 | J2.15 43.69,15.3 43.31,14.92
  Bottom 0.152: 25.65,7.62 24.87,6.84 v24.87,5.79 | 23.35,7.62 22.84,7.62 v22.32,7.1
  Bottom 0.254: v45.21,15.24 45.21,16.51 45.85,17.14 60.45,17.14 60.93,16.67 60.93,5.3 59.18,3.56 49.78,3.56 | v48.77,2.54 49.78,3.56 | 49.78,3.56 v47.24,3.56 | v22.63,13.65 22.64,13.63 22.64,9.86 | v21.39,11.1 22.64,9.86 | 22.64,8.86 22.64,8.32 23.35,7.62 25.65,7.62 | 22.64,8.86 22.1,9.4 21.48,9.4 v21.46,9.37 19.88,7.8 19.88,7.4 18.83,6.35 14.6,6.35 13.35,7.6 13.35,9.57 v12.93,10 12.22,10 9.5,12.72 v9.5,12.75 | 22.64,9.86 22.64,8.86
  Bottom 0.305: v33.53,9.59 33.53,8.32 31.62,6.41 29.59,6.41 28.38,7.62 25.65,7.62
32K_XN
  Top 0.152: C2-Q32K.2 31.11,7.17 Q32K.1 29.94,7.17 30.16,7.39 30.16,7.58 30.02,7.72 28.17,7.72 27.9,7.45 27.52,7.45 27.38,7.6 U$3.13
32K_XP
  Top 0.152: C1-Q32K.2 29.45,5.24 29.68,5.47 Q32K.2 29.63,5.63 29.03,5.63 28.85,5.8 28.85,7.08 28.61,7.32 28.23,7.32 28.05,7.15 27.36,7.15 27.02,7.48 U$3.12
GND  (via drill 0.3, 0.35)
  Top 0.508: C3_PWR.2 46.59,13.97 C2_PWR.1
  other vias: 11.68,2.92 44.83,11.49 47.12,15.75 48.77,10.86 55.63,14.99 61.85,13.97 5.71,17.34 5.71,16.45 5.71,15.56 5.71,14.61 5.71,13.72 5.71,12.83 5.71,11.94 5.71,11.05 5.71,10.16 5.71,7.62 5.71,6.73 5.71,5.84 5.71,4.95 6.48,4.45 7.37,4.45 13.46,4.45 5.71,2.54 6.99,2.92 7.87,2.92 8.76,2.92 9.65,2.92 10.86,6.73 12.57,2.92 13.46,2.92 15.24,2.92 15.24,4.45 13.34,5.33 55.12,5.84 46.99,4.95 52.32,14.22 32.77,9.59 16.57,13.35 17.53,13.35 18.48,13.35 19.18,12.63 19.18,11.74 19.18,10.85 19.18,8.66 19.18,7.71 18.48,6.99 16.57,6.99 17.53,6.99 15.88,7.52 15.88,10.85 15.88,11.74 15.88,12.63 13.34,6.22 12.64,6.73 11.75,6.73 14.35,4.45 5.71,0.64 16.13,4.45 17.02,4.45 17.91,4.45 18.8,4.45 19.68,4.45 20.57,4.45 22.1,5.59 22.67,6.22 22.92,4.25 24.1,5.77 22.29,3.62 20.57,2.92 19.68,2.92 21.46,3.17 18.8,2.92 17.91,2.92 17.02,2.92 16.13,2.92 14.35,2.92 6.41,10.6 6.41,11.49 6.41,12.38 6.41,13.27 6.41,14.16 6.41,15.05 6.41,16.89 6.41,16 41.02,4.83 13.55,13.48 24.36,2.64 31.6,3.35 42.23,10.16 40.4,7.99 26.77,2.72 38.54,5.91 36.96,5.91 25.44,10.6 24.25,10.6 26.65,10.6 26.65,9.37 25.44,9.37 24.25,9.37 24.25,11.79 25.44,11.79 26.65,11.79 11.75,7.58
  pour Top: 5.33,18.41 5.33,-0.38 64.26,-0.38 64.26,18.41
  pour Bottom: 5.33,18.67 5.33,-0.64 64.52,-0.64 64.52,18.67
GPI34  (via drill 0.3)
  Top 0.152: v28.32,5.93 28.26,5.99 27.62,5.99 26.32,7.29 U$3.10
  Bottom 0.152: v28.32,5.93 27.31,6.94 26.25,6.94 25.98,6.67 25.98,5.4 23.35,2.77 23.35,1.35 J1.7
GPI35  (via drill 0.3)
  Top 0.152: v28.32,6.69 28.27,6.75 27.31,6.75 26.68,7.38 U$3.11
  Bottom 0.152: v28.32,6.69 27.77,7.24 26.1,7.24 25.67,6.81 25.67,5.52 21.48,1.33 J1.6
GPIO0  (via drill 0.3, 0.35)
  Top 0.152: MODE_BUTTON.2 58.91,16.53 58.93,16.51 v60.07,16.51 62.99,16.51 63.01,16.53 MODE_BUTTON.1 | R4-ESP.1 32.69,7.48 32.69,4.78 32.84,4.62 UMH3NFHATN.3 33.5,4.3 | v36.86,11.99 35.23,11.99 34.92,11.68 32.01,11.68 30.88,12.81 29.97,12.81 28.99,11.82 U$3.23 | 33.5,4.3 33.5,1.36 J1.11 | 33.5,4.3 33.73,4.06 v34.42,4.06
  Bottom 0.152: v60.07,16.51 60.45,16.13 60.45,7.37 57.21,4.13 44.45,4.13 43.23,5.35 42.65,5.35 41.36,4.06 38.48,4.06 | v34.42,4.06 38.48,4.06 | 38.48,4.06 37.86,4.69 37.86,10.99 v36.86,11.99
GPIO2  (via drill 0.3)
  Top 0.152: v30.42,12.26 29.84,12.26 29.06,11.47 U$3.22
  Bottom 0.152: v30.42,12.26 30.7,12.53 30.7,13.82 31.03,14.16 32.51,14.16 33.08,13.59 33.08,12.67 33.59,12.16 35.94,12.16 37.55,10.55 37.55,4.58 37.34,4.37 34.96,4.37 34.71,4.62 34.14,4.62 33.77,4.24 29.5,4.24 28.87,4.87 26.57,4.87 25.91,4.21 J1.8
GPIO4
  Top 0.152: J2.14 40.01,15.52 34.63,15.52 34.33,15.22 32.31,15.22 31.99,14.9 30.06,14.9 29.74,14.58 29.74,13 28.91,12.18 U$3.24
GPIO5
  Top 0.152: J2.6 21.67,15.82 22.6,15.82 24.57,13.85 U$3.34
GPIO6
  Top 0.152: J2.9 27.66,15.88 27.33,15.88 25.62,14.18 U$3.31
GPIO7
  Top 0.152: J2.8 25.91,14.91 25.27,14.28 U$3.32
GPIO8
  Top 0.152: J2.7 23.37,15.51 24.93,13.96 U$3.33
GPIO9
  Top 0.152: J2.12 35.23,15.82 34.49,15.82 34.19,15.52 32.17,15.52 31.86,15.22 29.76,15.22 29.46,14.92 27.67,14.92 26.68,13.93 U$3.28
GPIO10
  Top 0.152: J2.11 32.69,15.82 32.02,15.82 31.71,15.52 29.62,15.52 29.32,15.22 27.54,15.22 26.32,14 U$3.29
GPIO11
  Top 0.152: J2.10 30.2,15.88 29.53,15.88 29.17,15.52 27.41,15.52 25.98,14.08 U$3.30
GPIO12
  Top 0.152: J1.10 32.51,2.85 32.51,4.53 32.33,4.7 32.33,9.24 31.83,9.74 31,9.74 30.67,10.07 U$3.18
GPIO14
  Top 0.152: J1.9 29.56,2.45 31.62,2.45 32.2,3.03 32.2,4.4 32,4.61 32,9.15 31.71,9.44 30.86,9.44 30.58,9.73 U$3.17
GPIO16  (via drill 0.3)
  Top 0.152: U$3.25 28.72,13.1 v29.15,13.53
  Bottom 0.152: v29.15,13.53 29.16,13.53 29.7,14.06 29.7,14.69 28.89,15.5 11.83,15.5 J2.2
GPIO17  (via drill 0.3)
  Top 0.152: v29.15,14.35 28.89,14.61 27.79,14.61 27.02,13.85 U$3.27
  Bottom 0.152: v29.15,14.35 29.15,14.8 28.74,15.2 9.59,15.2 J2.1
INT  (via drill 0.3)
  Top 0.152: v12.75,13.48 12.35,13.48 11.94,13.07 R1_ALS.1 | v30.86,11.56 30.86,11.18 30.45,10.78 U$3.20 | SENSOR1.3 v10.35,8.3
  Bottom 0.152: J1.1 9.08,1.33 10.38,2.63 10.38,5.27 9.63,6.02 9.63,7.58 v10.35,8.3 10.35,8.7 7.94,11.11 7.94,13.7 9.12,14.88 11.34,14.88 | v30.86,11.56 30.23,10.92 29.78,10.92 29.39,11.32 29.39,12.05 26.55,14.88 11.34,14.88 | v12.75,13.48 11.34,14.88
LBO  (via drill 0.3, 0.35)
  Top 0.152: CONVERTER.4 48.14,11.56 | R1_PWR.2 47.89,11.19 v47.56,10.86 | v44.83,10.6 44.64,10.6 44.26,10.22 44.26,8.13 44.45,7.94 44.44,2.99 44.07,2.62 39.89,2.62 J1.13 | v29.97,11.56 v29.97,11.55 29.6,11.55 29.18,11.12 U$3.21
  Top 0.254: 48.14,11.56 R1_PWR.2
  Bottom 0.152: v47.56,10.86 47.31,10.6 v44.83,10.6 43.05,10.6 42.1,11.56 38.05,11.56 37.05,12.56 33.72,12.56 33.39,12.89 33.39,13.75 32.65,14.48 30.86,14.48 30.38,13.99 30.38,13.04 29.7,12.36 29.7,11.83 v29.97,11.56
LNA_IN
  Top 0.152: JP2.1 12.47,3.87 | U$3.2 23.52,6.87
  Top 0.508: 12.47,3.87 12.66,3.68 20.16,3.68 arc45 22.06,4.47 22.86,5.27 arc45 23.52,6.87 | JP2.1 JP1.1
MISO  (via drill 0.3)
  Top 0.152: U$3.38 22.37,13.1 v21.83,13.64 | v13.15,14.35 v13.16,14.36 13.16,16.61 J2.3
  Bottom 0.152: v21.83,13.64 21.6,13.88 16.23,13.88 14.97,12.62 14.51,12.62 14.19,12.94 14.19,14.18 14.03,14.35 v13.15,14.35
MOSI
  Top 0.152: J2.4 16.89,15.52 19.4,15.52 19.7,15.22 22.3,15.22 23.88,13.64 U$3.36
N$1
  Top 0.152: 53.34,11.44 53.22,11.56 CONVERTER.7 | R1_PWRLBI.2 54.96,11.32
  Top 0.254: R1_PWRLBI.2 53.35,11.44 53.34,11.44 | 54.96,11.32 R2_PWRLBI.2
N$2  (via drill 0.3)
  Top 0.152: R5-ESP.1 37.42,10.97 v36.6,10.15 | v14.75,13.15 15.78,14.18 18.93,14.18 20.11,13.01 20.75,13.01 22.28,11.47 U$3.41
  Bottom 0.152: v36.6,10.15 36.6,10.6 35.64,11.56 33.34,11.56 32.18,10.4 32.18,8.38 31.2,7.4 30.14,7.4 28.78,8.77 28.78,11.8 26.4,14.18 15.78,14.18 v14.75,13.15
N$3
  Top 0.152: U$1.P$4 34.8,13.62
  Top 0.203: 34.8,13.62 34.63,13.46 R_B.2
N$4
  Top 0.152: U$1.P$3 34.53,14.57 R_G.2
N$5
  Top 0.152: R_R.2 34.95,12.38 35.65,13.08 36.51,13.08 36.77,13.34 36.77,14.22 37.02,14.48 37.52,14.48
  Top 0.203: U$1.P$2 37.52,14.48
N$6
  Top 0.152: U4.1 37.85,4.51 37.67,4.68 35.4,4.68 UMH3NFHATN.4 35.27,4.68 34.69,4.68 34.16,5.21 33.56,5.21 UMH3NFHATN.2
N$7
  Top 0.152: U4.2 38.48,4.51 37.66,5.33 35.4,5.33 UMH3NFHATN.5 35.27,5.33 34.67,5.33 34.15,5.86 33.56,5.86 UMH3NFHATN.1
N$8
  Top 0.508: ANTENNA.ANT 11.53,3.68 11.66,3.81 JP2.2
N$9
  Top 0.152: C6_USB.1 41.59,10.97 41.59,9.16 U4.14 U4.13 42.29,8.38 42.42,8.26 43.69,8.26 44.13,7.81 44.13,3.17 43.88,2.92 39.24,2.92 39.12,3.05 U4.3
N$10  (via drill 0.35)
  Top 0.152: v49.66,13.72 v49.65,13.71 CONVERTER.1 | 53.61,10.16 v54.61,10.16 54.86,10.16 55.12,10.41 56.77,10.41 57.4,11.05 57.4,14.91 | CONVERTER.6 52.45,9.91 | 52.45,9.91 52.69,10.14 53.34,10.14 | 52.45,9.91 52.2,9.65 C1_PWR.2 | v51.94,4.7 D3.1 51.94,2.07
  Top 0.254: 53.34,10.14 R1_PWRLBI.1 53.61,10.16 | 57.4,14.91 CDRH4D28.1 | D2.1 51.94,2.07
  Bottom 0.152: v54.61,10.16 50.29,10.16 | 50.29,10.16 49.66,10.79 v49.66,13.72 | 50.29,10.16 51.94,8.51 v51.94,4.7
N$11
  Top 0.152: C1-ESP.2 16.96,6.04 17.07,6.15 20.55,6.15 22.1,7.7 22.1,8.82 22.3,9.03 U$3.48
  Top 0.203: R2-ESP.1 14.46,5.32 C2-ESP.1 17.08,5.32 C1-ESP.2
N$12  (via drill 0.35)
  Top 0.152: CONVERTER.3 48.9,12.06 v48.77,12.19 | v52.45,16.51 52.45,16.26 52.2,16 R1_PWRFB.1
  Top 0.254: R1_PWRFB.1 R2_PWRFB.2
  Bottom 0.152: v48.77,12.19 48.77,16.38 49.02,16.64 52.32,16.64 v52.45,16.51
N$14
  Top 0.152: C2-ESP.2 16.12,6.62 16.29,6.45 20.41,6.45 21.77,7.81 21.77,8.93 22.23,9.38 U$3.47
  Top 0.203: R2-ESP.2 14.46,6.62 C2-ESP.2
N$16
  Top 0.152: U4.17 39.79,9.06 39.79,8.3 39.65,8.17 36.67,8.17 36.46,8.38 RXLED.C
N$17  (via drill 0.35)  (1 unrouted)
  Top 0.152: D1.1 49.78,2.12
  Top 0.254: 49.78,2.12 D2.2
  Top 0.508: v49.78,4.7 D1.1 | BATTERY.PWR@1 52.38,8.95 52.22,8.8 48.96,8.8
  Bottom 0.152: 48.96,8.89 48.9,8.95
  Bottom 0.508: v49.78,4.7 49.78,8.06 48.96,8.89
N$18
  Top 0.508: U.FL.3 8.49,4.59 10.45,4.59 10.79,4.94 10.79,5.33 11.05,5.59 JP1.2
N$20
  Top 0.152: R6_USB.2 41.21,12.23 41.21,11.86 41.32,11.75 43.24,11.75 43.5,11.49 43.5,10.36 42.99,9.86 42.99,9.16 U4.12
N$21
  Top 0.152: 53.33,12.56 CONVERTER.9
  Top 0.254: CDRH4D28.2 53.93,13.16 53.33,12.56
N$22
  Top 0.254: R1_USB.1 34.4,8.61 RXLED.A
N$23
  Top 0.152: U4.10 43.56,6.87 43.06,7.37 TXLED.C
N$24
  Top 0.152: R2_USB.1 34.9,10.54 35.03,10.41 35.03,7.66 34.73,7.37 TXLED.A
N$26
  Top 0.152: R5_USB.2 43.58,12.35 43.81,12.11 43.81,10.05 43.56,9.79 U4.11
N$34
  Top 0.152: C3-ESP.1 26.44,3.5 26.65,3.71 26.65,5.22 24.93,6.95 U$3.6
N$35
  Top 0.152: C3-ESP.2 26.02,4.8 26.02,5.4 24.57,6.85 U$3.5
N$36
  Top 0.152: C4-ESP.1 27.16,3.5 26.95,3.7 26.95,5.35 25.27,7.03 U$3.7
N$38
  Top 0.152: C4-ESP.2 27.46,5 27.46,5.29 25.62,7.13 U$3.8
RESET  (via drill 0.3, 0.35)
  Top 0.152: BD48E27G-TR.P$1 46.04,3.24 v45.72,3.56 | UMH3NFHATN.6 36.23,5.92 36.48,6.17 36.48,6.79 36.75,7.06 42.67,7.06 42.93,6.8 v42.93,4.83 | C1_SUP.2 28.88,3.35 28.57,3.66 v28.57,4.32 28.57,5.14 28.34,5.37 27.81,5.37 25.98,7.21 U$3.9 | RESET_BUTTON.3 58.94,1.21 v60.07,1.21 63.01,1.21 RESET_BUTTON.4
  Top 0.254: BD48E27G-TR.P$1 46.21,2.33 46.21,1.27 R1-ESP.1
  Bottom 0.152: v42.93,4.83 42.93,4.06 43.24,3.75 | 38.48,3.75 34.92,3.75 34.67,3.49 34.16,3.49 33.72,3.94 28.96,3.94 v28.57,4.32 | 38.48,3.75 43.24,3.75 | 43.24,3.75 45.53,3.75 v45.72,3.56 47.31,1.97 49.09,1.97 50.27,3.15 60.03,3.15 60.45,2.73 60.45,1.59 v60.07,1.21 | 38.48,3.75 J1.12
RGB_B  (via drill 0.3)
  Top 0.152: v32.26,13.59 33.07,13.59 R_B.1 | v30.48,8.26 27.73,8.26 27.73,8.25 U$3.14
  Bottom 0.152: v32.26,13.59 32.38,13.46 32.38,12.7 32.08,12.4 32.08,11.16 31.57,10.65 31.57,8.65 31.18,8.26 v30.48,8.26
RGB_G  (via drill 0.3)
  Top 0.152: v31.24,13.59 32.19,14.54 R_G.1 | U$3.15 29.25,9.03 29.41,8.87 v29.97,8.87
  Bottom 0.152: v29.97,8.87 30.97,9.86 30.97,10.9 31.45,11.38 31.45,12.37 31.11,12.7 31.11,13.46 v31.24,13.59
RGB_R  (via drill 0.3)
  Top 0.152: v30.99,8.87 30.45,9.4 29.3,9.4 29.27,9.38 U$3.16 | R_R.1 31.92,12.38 31.75,12.55 v31.75,12.95
  Bottom 0.152: v30.99,8.87 31.27,9.15 31.27,10.78 31.75,11.25 v31.75,12.95
RX0  (via drill 0.3)
  Top 0.152: v14.73,13.91 14.73,14.22 14.99,14.48 19.06,14.48 20.23,13.31 20.88,13.31 22.36,11.82 U$3.40 | U4.20 37.85,9.19 37.76,9.28 v36.62,9.28
  Bottom 0.152: v14.73,13.91 15.31,14.48 26.52,14.48 29.08,11.92 29.08,8.89 30.27,7.7 31.07,7.7 31.88,8.51 31.88,10.52 33.21,11.86 35.81,11.86 37.2,10.47 37.2,9.86 v36.62,9.28
SCK
  Top 0.152: J2.5 19.13,15.82 19.55,15.82 19.85,15.52 22.43,15.52 24.23,13.72 U$3.35
SCL  (via drill 0.3, 0.35)
  Top 0.152: v12.93,12.33 13.83,12.33 R2_PINH.1 13.98,12.28 14.17,12.47 14.17,14.11 14.87,14.81 19.17,14.81 20.36,13.62 21,13.62 22.44,12.18 U$3.39 | SENSOR2.4 10.47,11.15 v9.4,11.15 10.65,9.9 10.65,9.15 10.85,8.95 SENSOR1.5
  Bottom 0.152: v12.93,12.33 12.51,12.33 10.66,14.18 9.51,14.18 8.54,13.21 8.54,12.01 v9.4,11.15 11.2,9.35 11.2,7.95 10.28,7.03 10.28,6.34 10.99,5.63 10.99,2.6 12.26,1.33 J1.3
SDA  (via drill 0.3, 0.35)
  Top 0.152: U$3.42 22.2,11.12 20.62,12.7 19.94,12.7 18.77,13.88 16.23,13.88 15.24,12.89 15.24,12.46 15.06,12.28 R1_PINH.1 14.96,11.85 14.78,11.67 13.04,11.67 12.93,11.55 v12.93,11.15 | SENSOR2.3 8.92,11.97 8.65,11.7 v8.65,11.15 9.25,10.55 9.5,10.55 10.15,9.9 10.15,9.15 9.95,8.95 SENSOR1.2
  Bottom 0.152: v12.93,11.15 13.24,11.15 13.48,11.4 13.48,12.55 13.15,12.88 12.43,12.88 10.83,14.48 9.39,14.48 8.24,13.34 8.24,11.56 v8.65,11.15 10.9,8.9 10.9,8.07 9.98,7.16 9.98,6.14 10.68,5.44 10.68,1.35 J1.2
TX0  (via drill 0.3)
  Top 0.152: R5-ESP.2 39.38,10.97 39.2,10.8 v39.2,10.15 | U4.4 v39.75,4.85
  Bottom 0.152: v39.2,10.15 39.75,9.6 v39.75,4.85
USB_DATA_N
  Top 0.254: R6_USB.1 41.34,13.16 41.49,13.02 42.21,13.02 | 42.21,13.02 42.46,12.77 C1_USB.1 | 42.21,13.02 45.12,13.02 arc-90 45.44,12.7 arc-45 45.44,12.69 45.44,8.54 arc45 45.9,7.43 arc45 47.04,6.96 56.48,6.96 arc45 57.15,7.24 57.99,8.08 arc-45 58.37,8.24 MOLEX.2
USB_DATA_P
  Top 0.203: C2_USB.1 R5_USB.1
  Top 0.254: C2_USB.1 45.29,13.67 arc-90 45.85,13.11 45.85,8.54 arc45 46.19,7.72 arc45 47.04,7.37 49.78,7.37 arc90 50.16,7.75 arc-90 50.55,8.13 arc-90 50.93,7.75 arc90 51.31,7.37 arc90 51.69,7.75 arc-90 52.07,8.13 arc-90 52.45,7.75 arc90 52.83,7.37 arc90 53.21,7.75 arc-90 53.59,8.13 arc-90 53.98,7.75 arc90 54.36,7.37 56.48,7.37 arc45 56.86,7.53 58.13,8.79 arc-45 58.37,8.89 MOLEX.3
VDD3P3_SDIO  (via drill 0.3)
  Top 0.152: v28.38,13.91 28.11,14.18 27.82,14.18 27.38,13.74 U$3.26
  Bottom 0.152: v28.38,13.91 28.38,13.47 28.91,12.95 29.42,12.95 30.08,13.61 30.08,14.12 30.74,14.78 36.73,14.78 J2.13
VIN_BAT
  Top 0.254: J1.15 44.96,2.6 44.96,5.46 45.43,5.93 49.6,5.93 D1.2
VIN_USB  (via drill 0.3, 0.35)
  Top 0.152: 53.53,5.75 D3.2 51.94,6.35 51.68,6.61 45.66,6.61 44.83,7.43 v44.83,9.78 | 41.02,9.29 41.01,9.3 41.01,9.78 40.7,10.09 v40.7,10.99 40.7,11.4 40.22,11.88 C5_USB.1 C4_USB.1
  Top 0.254: 41.02,9.29 U4.15 | FUSE_USB.2 53.53,4.99 53.53,5.75
  Bottom 0.152: v40.7,10.99 42.24,10.99 42.93,10.3 44.31,10.3 v44.83,9.78
VUSB
  Top 0.152: MOLEX.1 58.52,7.59 57.66,6.73 C3_USB.1 56.56,5.73
  Top 0.254: 5V.1 55.18,1.52 56.54,2.88 FUSE_USB.1 56.54,5.71 56.56,5.73
XTAL_N
  Top 0.152: C2-Q1.2 16.93,11.05 Q40M.3 16.88,10.3 17.03,10.15 20.85,10.15 21.12,10.43 U$3.44
XTAL_P
  Top 0.152: C1-Q1.2 18.23,9.25 Q40M.1 18.18,9.35 18.19,9.36 20.51,9.36 21.23,10.07 U$3.45

### Text on the board
bPlace: 17 | 16 | MISO | MOSI | SCK | 5 | 8 | 7 | 6 | 11 | 10 | 9 | 4 | 3V3 | INT | SDA | SCL | GND | GND | RST | GND | BAT | 35 | 34 | 14 | 12 | 2 | 0